# Altium schematic sheet loom-umbilical-box.SchDoc
size 297 x 209 mm
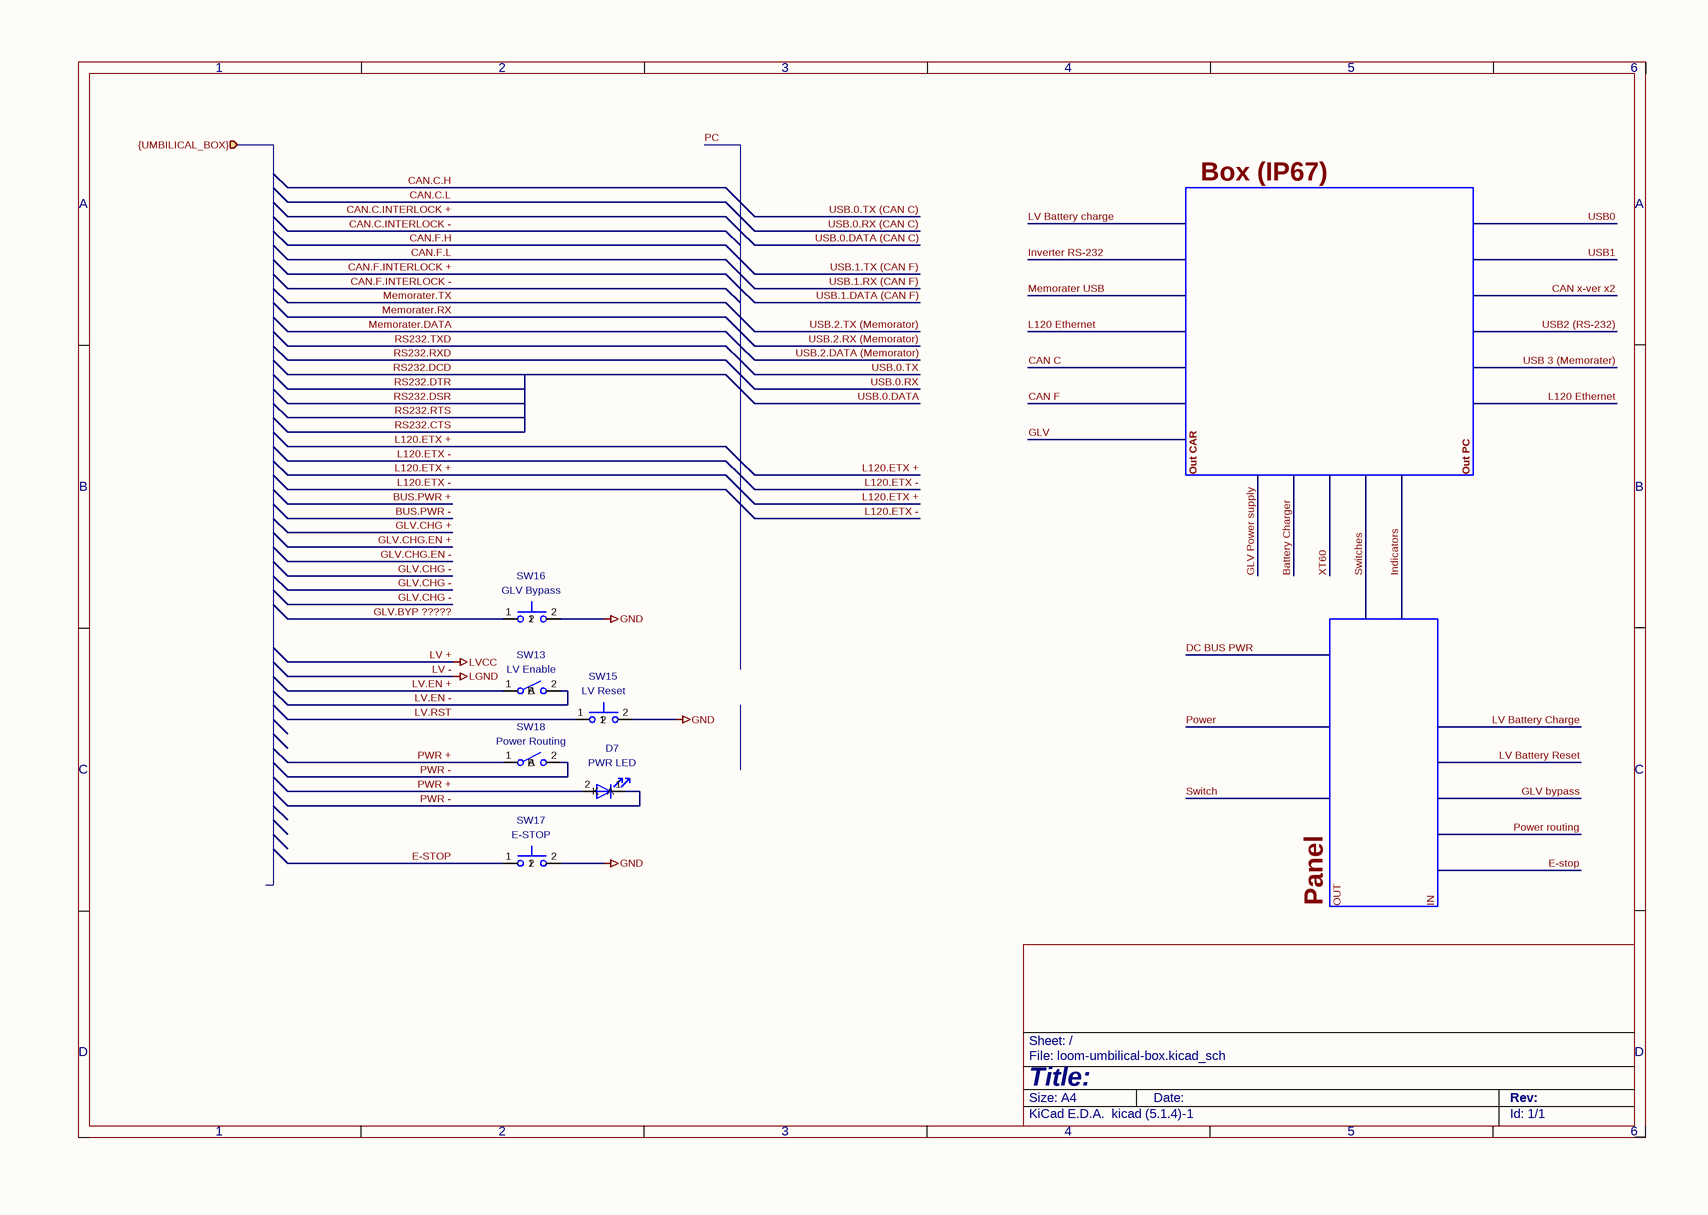
[diagram p0: loom-umbilical-box.SchDoc]

## Parts
D7  PWR LED
SW13  LV Enable
SW15  LV Reset
SW16  GLV Bypass
SW17  E-STOP
SW18  Power Routing

## Ports
{UMBILICAL_BOX} (in)

## Nets
GND: SW15.2 SW16.2 SW17.2
E-stop: SW17.1
GLV.BYP ?????: SW16.1
LV.EN +: SW13.1(A)
LV.EN -: SW13.2(B)
LV.RST: SW15.1
PWR +: D7.2(A) SW18.1(A)
PWR -: D7.1(K) SW18.2(B)

## Buses and harness runs
bus PC

## Notes on the sheet
- Labels drawn without touching a wire or pin: Box (IP67), IN, OUT, Out CAR, Out PC, Panel
- 1
- 2
- 3
- 4
- 5
- 6
- A
- B
- C
- D
- Title:
- File: loom-umbilical-box.kicad_sch
- Sheet: /
- KiCad E.D.A.  kicad (5.1.4)-1
- Size: A4
- Date:
- Rev:
- Id: 1/1

## Library data of the parts
D7 = LED: Description: Light emitting diode; Sim.Pins: 1=K 2=A; Value: PWR LED
SW13 SW18 = SW_SPST: Description: Single Pole Single Throw (SPST) switch
  SW13: Value: LV Enable
  SW18: Value: Power Routing
SW15-SW17 = SW_Push: Description: Push button switch, generic, two pins
  SW15: Value: LV Reset
  SW16: Value: GLV Bypass
  SW17: Value: E-STOP